# EAGLE schematic remote-camera (EAGLE 7.3.0)
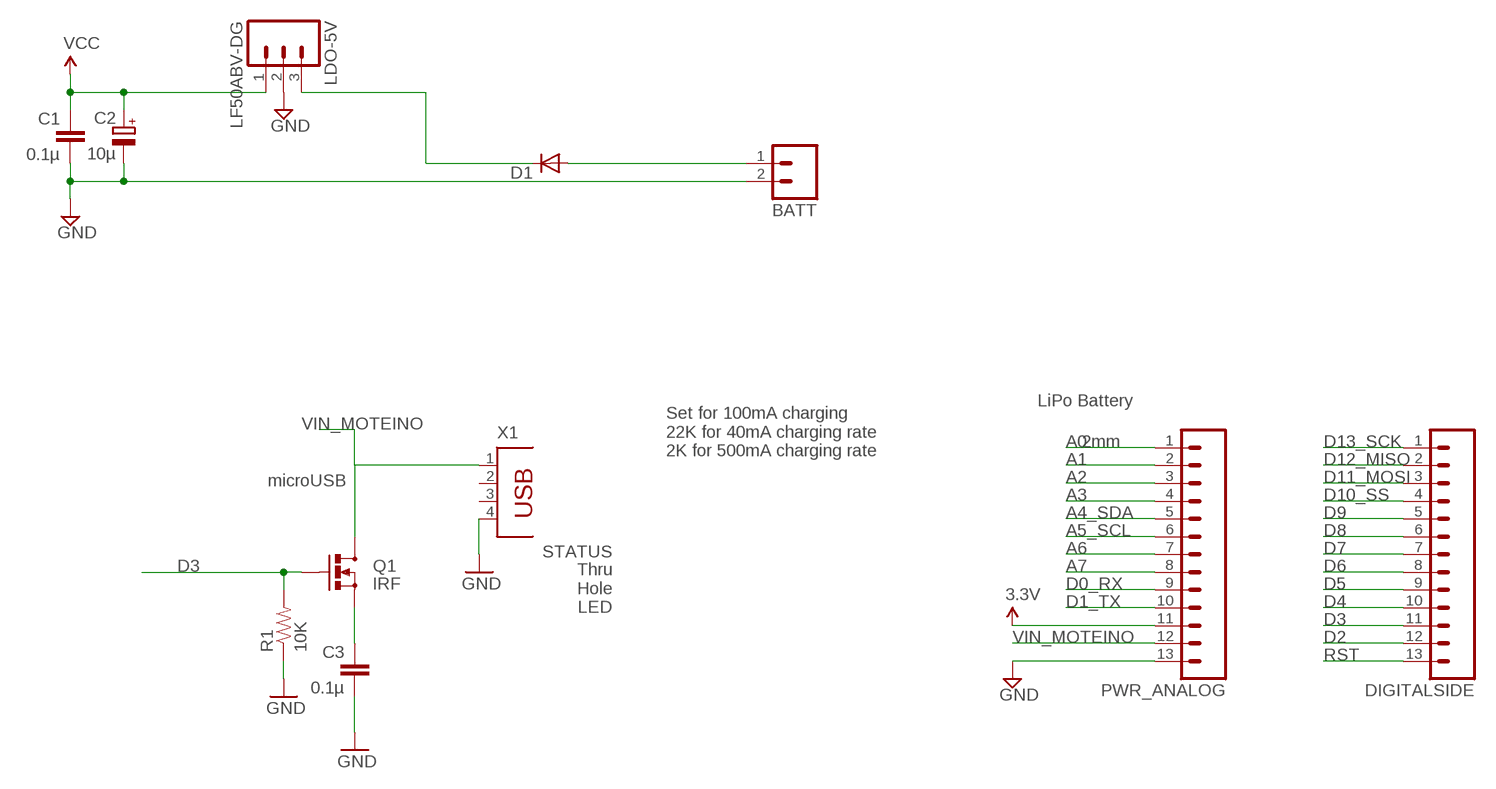
[diagram p0: schematic, sheet 1]

## Parts
BATT  M02PTH  [1X02]
C1  0.1µ  C-EU025-024X044  [C025-024X044]
C2  10µ  CPOL-EUE1.8-4  [E1,8-4]
C3  0.1µ  C-EU025-024X044  [C025-024X044]
D1  DIODE-D-5  [D-5]
DIGITALSIDE  HDR_13PINREGULAR  [1X13]
LDO-5V  LF50ABV-DG  M03PTH  [1X03]
PWR_ANALOG  HDR_13PINREGULAR  [1X13]
Q1  IRF  MOSFET-NCHANNELPTH2  [TO220V]
R1  10K  RESISTORPTH1  [AXIAL-0.3]
X1  PN87520  [PN87520]

## Nets
A0: PWR_ANALOG.1
A1: PWR_ANALOG.2
A2: PWR_ANALOG.3
A3: PWR_ANALOG.4
A4_SDA: PWR_ANALOG.5
A5_SCL: PWR_ANALOG.6
A6: PWR_ANALOG.7
A7: PWR_ANALOG.8
D0_RX: PWR_ANALOG.9
D1_TX: PWR_ANALOG.10
D2: DIGITALSIDE.12
D3: DIGITALSIDE.11 Q1.1(G) R1.P$2
D4: DIGITALSIDE.10
D5: DIGITALSIDE.9
D6: DIGITALSIDE.8
D7: DIGITALSIDE.7
D8: DIGITALSIDE.6
D9: DIGITALSIDE.5
D10_SS: DIGITALSIDE.4
D11_MOSI: DIGITALSIDE.3
D12_MISO: DIGITALSIDE.2
D13_SCK: DIGITALSIDE.1
GND [power]: BATT.2 C1.2 C2.- C3.2 LDO-5V.2 PWR_ANALOG.13 R1.P$1 X1.4
N$1: BATT.1 D1.A
N$2: C3.1 Q1.3(S)
N$6: D1.C LDO-5V.3
RST: DIGITALSIDE.13
VCC: C1.1 C2.+ LDO-5V.1 PWR_ANALOG.11 ; supply symbol labelled 3.3V
VIN_MOTEINO [power]: PWR_ANALOG.12 Q1.2(D) X1.1
Unconnected: X1.2 X1.3

## Notes on the sheet
- LiPo Battery
- 2mm
- Set for 100mA charging
  22K for 40mA charging rate
  2K for 500mA charging rate
- microUSB
- STATUS
- Thru
  Hole
  LED

## Library data of the parts
BATT = SparkFun-Connectors:M02: Standard 2-pin 0.1" header. Use with - straight break away headers ( PRT-00116) - right angle break away headers (PRT-00553) - swiss pins (PRT-00743) - machine pins (PRT-00117) - female headers (PRT-00115) Molex polarized connector foot print use with: PRT-08233 with associated crimp pins and housings. 2.54_SCREWTERM for use with PRT-10571. 3.5mm Screw Terminal footprints for PRT-08084 5mm Screw Terminal footprints for use with PRT-08432
C1 C3 = resistor:C-EU: CAPACITOR, European symbol
C2 = resistor:CPOL-EU: POLARIZED CAPACITOR, European symbol
D1 = diode:DIODE-: DIODE
DIGITALSIDE PWR_ANALOG = LowPowerLab:HDR_13PIN
LDO-5V = SparkFun-Connectors:M03: Header 3 Standard 3-pin 0.1" header. Use with straight break away headers (SKU : PRT-00116), right angle break away headers (PRT-00553), swiss pins (PRT-00743), machine pins (PRT-00117), and female headers (PRT-00115). Molex polarized connector foot print use with SKU : PRT-08232 with associated crimp pins and housings.
Q1 = SparkFun:MOSFET-NCHANNEL
R1 = SparkFun:RESISTOR: Resistor Basic schematic elements and footprints for 0603, 1206, and PTH 1/10th watt (small) resistors.
X1 = con-berg:PN87520: BERG USB connector; OC_FARNELL: unknown; OC_NEWARK: unknown

## Net classes
1 power: width 0.381 mm, clearance 0.254 mm